# EAGLE schematic Template_PiggyBack (EAGLE 9.6.2)
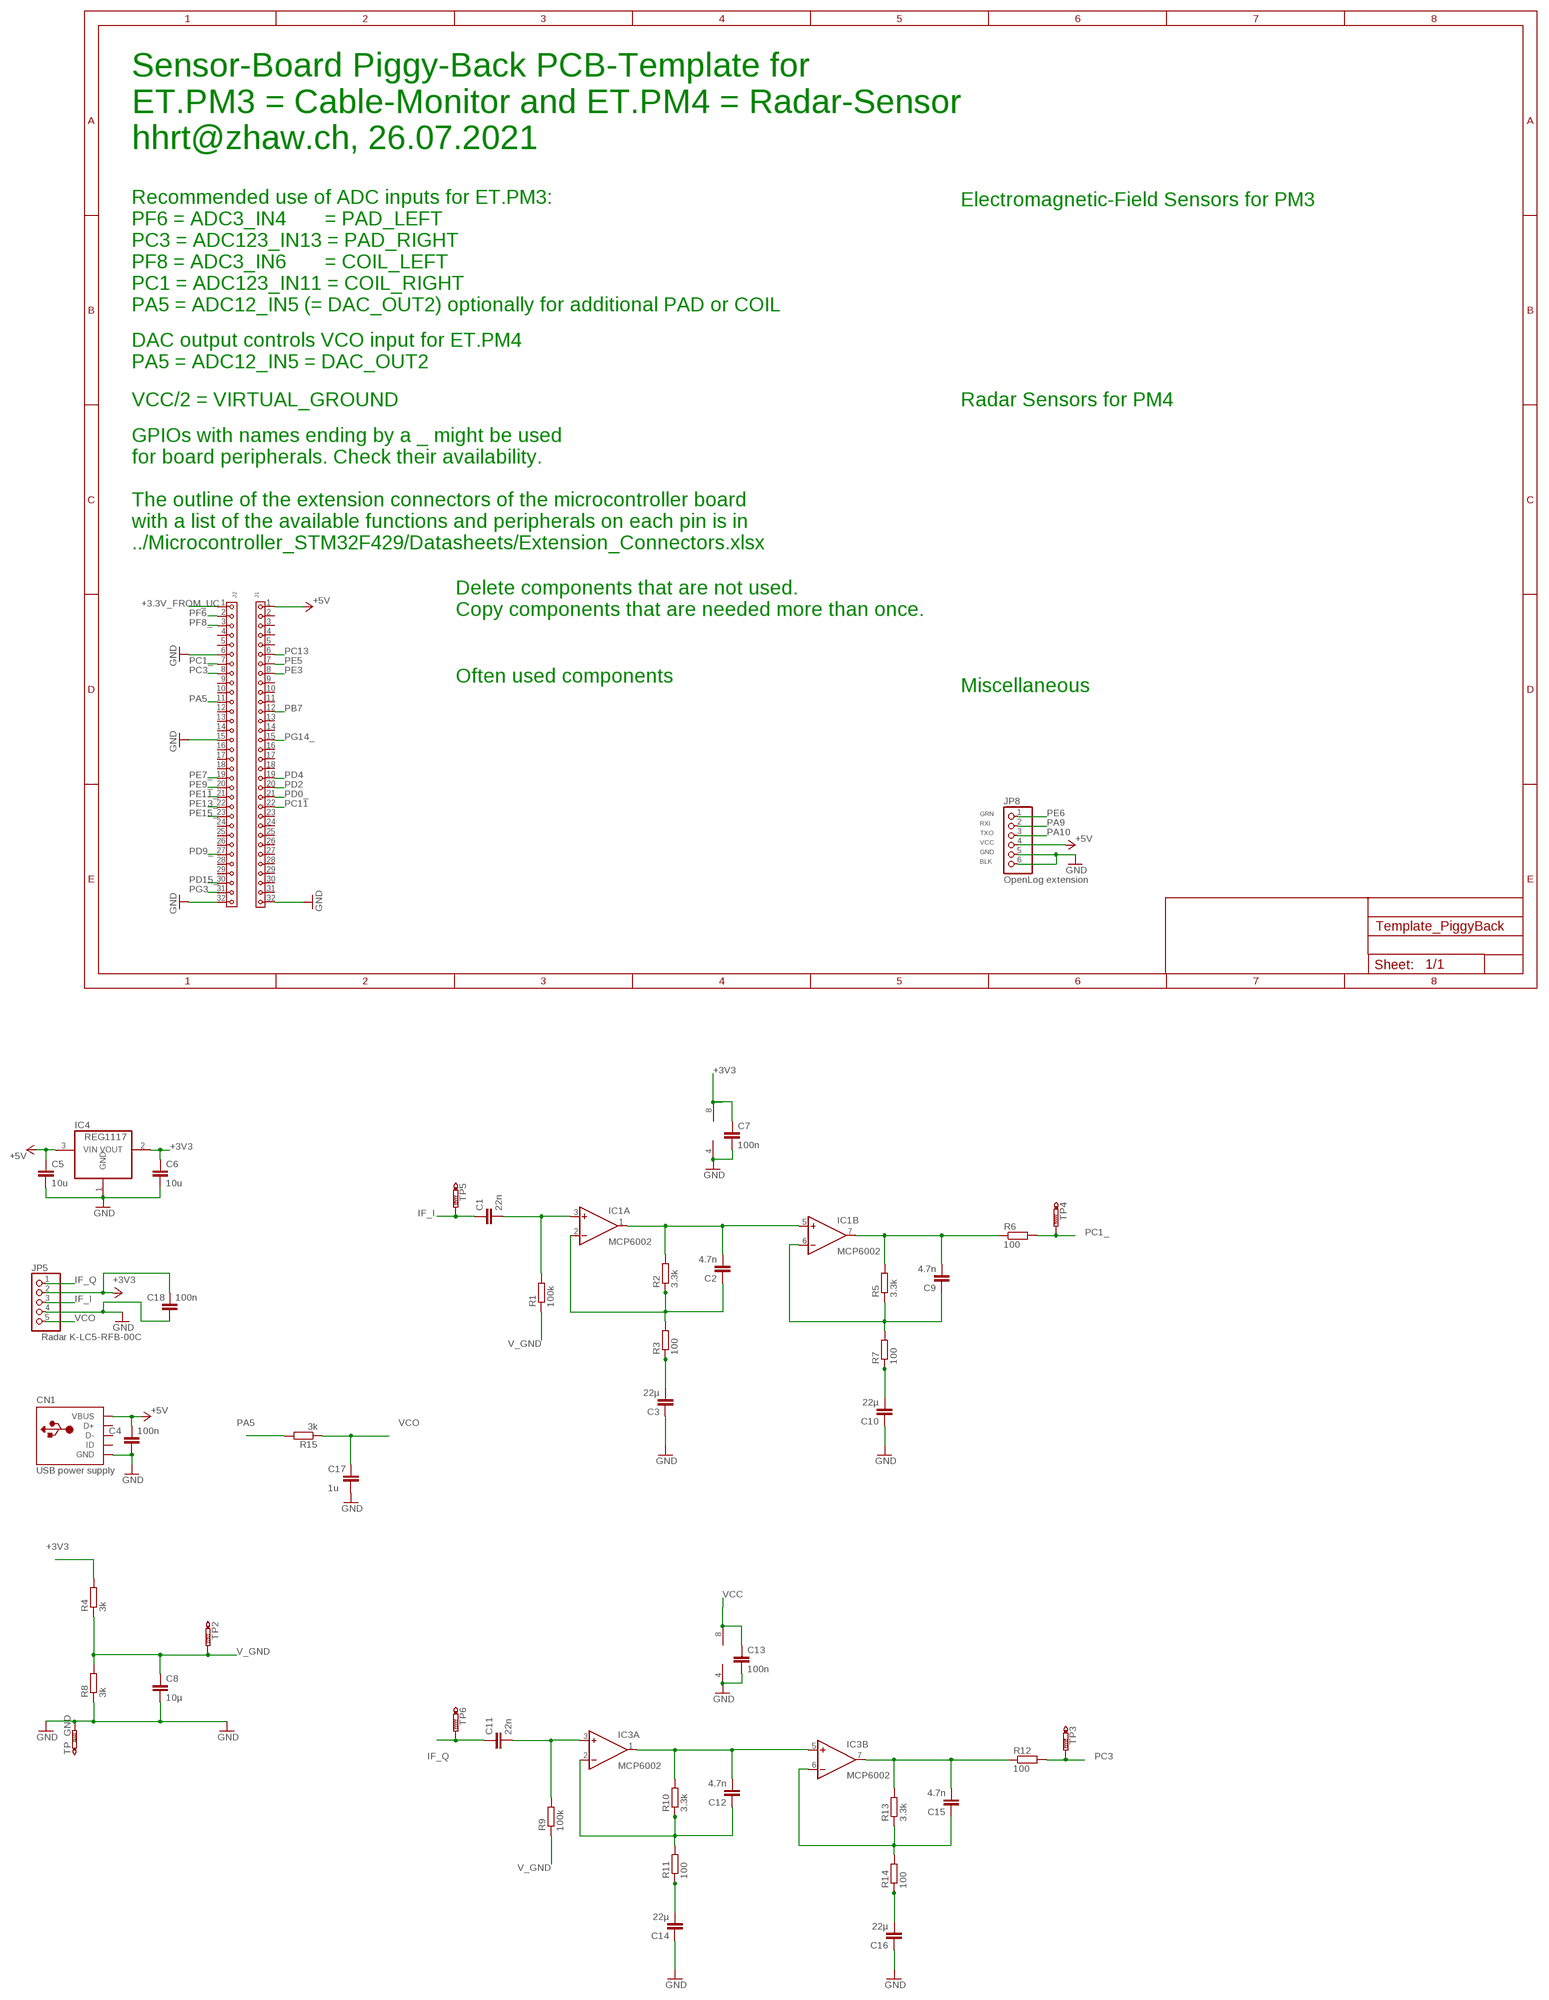
[diagram p0: schematic, sheet 1]

## Parts
C1  22n  C-EUC1206  [C1206]
C2  4.7n  C-EUC0805  [C0805]
C3  22µ  C-EUC0805  [C0805]
C4  100n  C-EUC0805  [C0805]
C5  10u  C-EUC0805  [C0805]
C6  10u  C-EUC0805  [C0805]
C7  100n  C-EUC0805  [C0805]
C8  10µ  C-EUC0805  [C0805]
C9  4.7n  C-EUC0805  [C0805]
C10  22µ  C-EUC0805  [C0805]
C11  22n  C-EUC1206  [C1206]
C12  4.7n  C-EUC0805  [C0805]
C13  100n  C-EUC0805  [C0805]
C14  22µ  C-EUC0805  [C0805]
C15  4.7n  C-EUC0805  [C0805]
C16  22µ  C-EUC0805  [C0805]
C17  1u  C-EUC0805  [C0805]
C18  100n  C-EUC0805  [C0805]
CN1  USB power supply  USBMINIB  [USB-MINIB]
IC1  MCP6002  OPA2333D  [SO08]
IC3  MCP6002  OPA2333D  [SO08]
IC4  REG1117  [SOT223]
J1  6130XX11821_61303211821  [61303211821]
J2  6130XX11821_61303211821  [61303211821]
JP5  Radar K-LC5-RFB-00C  PINHD-1X5  [1X05]
JP8  OpenLog extension  PINHD-1X6  [1X06]
R1  100k  R-EU_R0805  [R0805]
R2  3.3k  R-EU_R0805  [R0805]
R3  100  R-EU_R0805  [R0805]
R4  3k  R-EU_R0805  [R0805]
R5  3.3k  R-EU_R0805  [R0805]
R6  100  R-EU_R0805  [R0805]
R7  100  R-EU_R0805  [R0805]
R8  3k  R-EU_R0805  [R0805]
R9  100k  R-EU_R0805  [R0805]
R10  3.3k  R-EU_R0805  [R0805]
R11  100  R-EU_R0805  [R0805]
R12  100  R-EU_R0805  [R0805]
R13  3.3k  R-EU_R0805  [R0805]
R14  100  R-EU_R0805  [R0805]
R15  3k  R-EU_R0805  [R0805]
TP2  PTR1PAD1-17  [P1-17]
TP3  PTR1PAD1-17  [P1-17]
TP4  PTR1PAD1-17  [P1-17]
TP5  PTR1PAD1-17  [P1-17]
TP6  PTR1PAD1-17  [P1-17]
TP_GND  PTR1PAD1-17  [P1-17]

## Nets
+3.3V_FROM_UC: J2.1
+3V3: C6.1 C7.1 C18.1 IC1.8(P:V+) IC4.2(VOUT) JP5.2 R4.2
+5V: C4.1 C5.1 CN1.VBUS IC4.3(VIN) J1.1 JP8.4
GND: C3.1 C4.2 C5.2 C6.2 C7.2 C8.2 C10.1 C13.2 C14.1 C16.1 C17.2 C18.2 CN1.GND IC1.4(P:V-) IC3.4(P:V-) IC4.1(GND) J1.32 J2.6 J2.15 J2.32 JP5.4 JP8.5 JP8.6 R8.1 TP_GND.TP
IF_I: C1.1 JP5.3 TP5.TP
IF_Q: C11.1 JP5.1 TP6.TP
N$1: C3.2 R3.1
N$2: C2.1 IC1.2(A:-IN) R2.1 R3.2
N$3: C10.2 R7.1
N$4: C1.2 IC1.3(A:+IN) R1.2
N$5: C2.2 IC1.1(A:OUT) IC1.5(B:+IN) R2.2
N$7: C9.2 IC1.7(B:OUT) R5.2 R6.1
N$8: C9.1 IC1.6(B:-IN) R5.1 R7.2
N$9: C12.1 IC3.2(A:-IN) R10.1 R11.2
N$10: C16.2 R14.1
N$11: C11.2 IC3.3(A:+IN) R9.2
N$12: C12.2 IC3.1(A:OUT) IC3.5(B:+IN) R10.2
N$13: C15.2 IC3.7(B:OUT) R12.1 R13.2
N$14: C15.1 IC3.6(B:-IN) R13.1 R14.2
N$15: C14.2 R11.1
PA5: J2.11 R15.2
PA9: JP8.2
PA10: JP8.3
PB7: J1.12
PC1_: J2.7 R6.2 TP4.TP
PC3: J2.8 R12.2 TP3.TP
PC11: J1.22
PC13: J1.6
PD0_: J1.21
PD2: J1.20
PD4: J1.19
PD9_: J2.27
PD15_: J2.30
PE3: J1.8
PE5: J1.7
PE6: JP8.1
PE7_: J2.19
PE9_: J2.20
PE11_: J2.21
PE13_: J2.22
PE15_: J2.23
PF6: J2.2
PF8_: J2.3
PG3: J2.31
PG14_: J1.15
V_GND: C8.1 R1.1 R4.1 R8.2 R9.1 TP2.TP
VCC: C13.1 IC3.8(P:V+)
VCO: C17.1 JP5.5 R15.1
Unconnected: CN1.D+ CN1.D- CN1.ID J1.2 J1.3 J1.4 J1.5 J1.9 J1.10 J1.11 J1.13 J1.14 J1.16 J1.17 J1.18 J1.23 J1.24 J1.25 J1.26 J1.27 J1.28 J1.29 J1.30 J1.31 J2.4 J2.5 J2.9 J2.10 J2.12 J2.13 J2.14 J2.16 J2.17 J2.18 J2.24 J2.25 J2.26 J2.28 J2.29

## Notes on the sheet
- Sensor-Board Piggy-Back PCB-Template for
  ET.PM3 = Cable-Monitor and ET.PM4 = Radar-Sensor
  hhrt@zhaw.ch, 26.07.2021
- Electromagnetic-Field Sensors for PM3
- Recommended use of ADC inputs for ET.PM3:
  PF6 = ADC3_IN4       = PAD_LEFT
  PC3 = ADC123_IN13 = PAD_RIGHT
  PF8 = ADC3_IN6       = COIL_LEFT
  PC1 = ADC123_IN11 = COIL_RIGHT
  PA5 = ADC12_IN5 (= DAC_OUT2) optionally for additional PAD or COIL
- DAC output controls VCO input for ET.PM4
  PA5 = ADC12_IN5 = DAC_OUT2
- VCC/2 = VIRTUAL_GROUND | Radar Sensors for PM4
- GPIOs with names ending by a _ might be used
  for board peripherals. Check their availability.
- The outline of the extension connectors of the microcontroller board
  with a list of the available functions and peripherals on each pin is in
  ../Microcontroller_STM32F429/Datasheets/Extension_Connectors.xlsx
- Delete components that are not used.
  Copy components that are needed more than once.
- Often used components
- Miscellaneous
- GRN
- RXI
- TXO
- VCC
- GND
- BLK

## Library data of the parts
C1-C18 = rcl:C-EU: CAPACITOR, European symbol; SPICEPREFIX: C
CN1 = adafruit:USB: USB Connectors USBMINIB - Surface Mount Female Mini-B USB Connector 4UConnector: 06564 By microbuilder.eu Thru-hole RA Female Mini-B USB Connector 4UConnector: 18732 By ladyada.net
IC1 IC3 = linear:OPA2333: DUAL 1.8V, microPOWER CMOS OPERATIONAL AMPLIFIERS Zerø-Drift Series Source: Texas Instruments (Burr-Brown) .. U11 opa333 Operational Amp.pdf
IC4 = burr-brown:REG1117: 800mA and 1A Low Dropout (LDO) Positive Regulator 1.8V, 2.5V, 2.85V, 3.3V, 5V, and Adj; MPN: REG1117; OC_FARNELL: 1097566; OC_NEWARK: 14P6981
J1 J2 = Wurth_Connectors_WR-PHD:6130XX11821_61303211821: WR-PHD 2.54 mm Socket Header ARTICLE PROPERTIES: Pins:1;​ 2;​ 3;​ 4;​ 5;​ 6;​ 7;​ 8;​ 9;​ 10;​ 12;​ 13;​ 14;​ 15;​ 16;​ 18;​ 20;​ 22;​ 24;​ 25;​ 32;​ 36;​ 40 KIND PROPERTIES: Pitch：2.54 mm Quality Class:3 as per CECC 75 301-802 Rows：Single Gender：Socket Header;​ Female Type：Straight MATERIAL PROPERTIES: Insulator Material :PBT Insulator Flammability Rating:UL94 V-0 Contact Material:Copper Alloy Contact Plating:Gold Contact Type:Stamped GENERAL INFORMATION Operating Temperature:-40 up to +125 °C Compliance:Lead free / RoHS ELECTRICAL PROPERTIES: Rated Current:3 A IR 1:3 A Withstanding Voltage:500 V (AC) Contact Resistance:20 mΩ RISO:1000 MΩ CERTIFICATION UL Approval:E323964 PACKAGING PROPERTIES Packaging:Tray <https://katalog.we-online.com/media/images/v2/o33218v209%20Family_WR-PHD_613xxx11821.jpg> Details see: https://katalog.we-online.com/en/em/PHD_2_54_SOCKET_HEADER_6130XX11821 Updated by Yingchun,Shan 2019-10-21 2019 (C) Würth Elektronik; DATASHEET-URL: https://katalog.we-online.com/em/datasheet/61303211821.pdf; GENDER: Socket Header; IR: 3A; MATES: WR-PHD 2.54mm SMT Pin Header/THT Angled Pin Header/THT Pin Header; PACKAGING: Tray; PART-NUMBER: 61303211821; PINS: 32; ROWS: Single; TYPE: Straight
JP5 = pinhead:PINHD-1X5: PIN HEADER
JP8 = pinhead:PINHD-1X6: PIN HEADER
R1-R15 = rcl:R-EU_: RESISTOR, European symbol; SPICEPREFIX: R
TP2-TP6 TP_GND = testpad:PTR1: TEST PIN